# Altium schematic sheet Power.SchDoc
size A; SheetNumber: 5; SheetTotal: 7
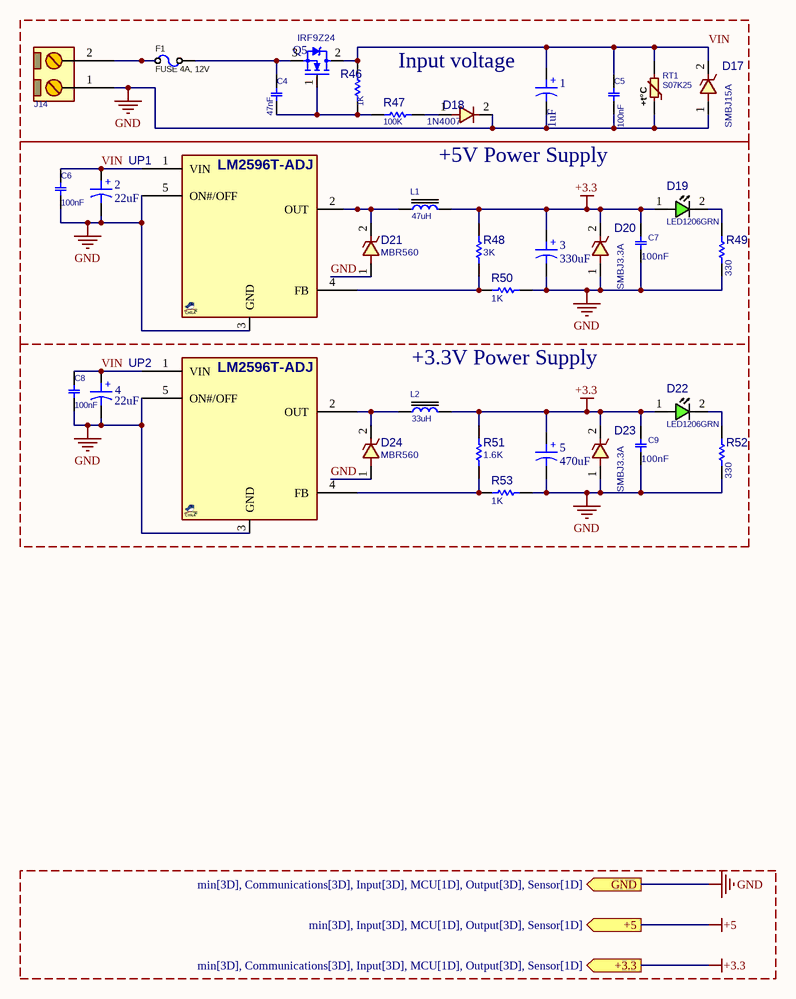
[diagram p0: Power.SchDoc]

## Parts
1  1uF  [Cap electrolitic radial 10x20-5]
2  22uF  [Cap electrolitic radial 10x20-5]
3  330uF  [Cap electrolitic radial 10x20-5]
4  22uF  [Cap electrolitic radial 10x20-5]
5  470uF  [Cap electrolitic radial 10x20-5]
C4  47nF  [C_CERM_D3]
C5  100nF  [C_CERM_D3]
C6  100nF  [C_CERM_D3]
C7  100nF  [C1206]
C8  100nF  [C_CERM_D3]
C9  100nF  [C1206]
D17  SMBJ15A  [D_SMB]
D18  1N4007  [D_AX03_1WS]
D19  LED1206GRN  [LED1206GRN]
D20  SMBJ3.3A  [D_SMB]
D21  MBR560  [D_AX04_DO41]
D22  LED1206GRN  [LED1206GRN]
D23  SMBJ3.3A  [D_SMB]
D24  MBR560  [D_AX04_DO41]
F1  FUSE 4A, 12V  [FUSH_6X32MM_4PIN]
J14  CONN_TB2  [TBB_2]  (value not drawn)
L1  47uH  [L_7]
L2  33uH  [L_7]
Q5  IRF9Z24  [TO247_3]
R46  1K  [R0125W_AX03]
R47  100K  [R0125W_AX03]
R48  3K  [R1206]
R49  330  [R1206]
R50  1K  [R1206]
R51  1.6K  [R1206]
R52  330  [R1206]
R53  1K  [R1206]
RT1  S07K25  [NTC_15X6]
UP1  LM2596T-ADJ  [TO220_5]  (value not drawn)
UP2  LM2596T-ADJ  [TO220_5]  (value not drawn)

## Ports
+3.3 (out, see min[3D], Communications[3D], Input[3D], MCU[1D], Output[3D], Sensor[1D]), +5 (out, see min[3D], Input[3D], MCU[1D], Output[3D], Sensor[1D]), GND (out, see min[3D], Communications[3D], Input[3D], MCU[1D], Output[3D], Sensor[1D])

## Nets
+3.3: 3.1 5.1 C7.1 C9.1 D19.1(ANODE) D20.2 D22.1(ANODE) D23.2 L1.2 L2.2 R48.1 R51.2 ; port +3.3
+5: port +5
GND: 1.2 2.2 3.2 4.2 5.2 C5.1 C6.1 C7.2 C8.1 C9.2 D17.1 D18.2 D20.1 D21.1 D23.1 D24.1 J14.1 R49.2 R50.2 R52.2 R53.2 RT1.1 UP1.3(GND) UP1.5(ON#/OFF) UP2.3(GND) UP2.5(ON#/OFF) ; port GND
VIN: 1.1 2.1 4.1 C5.2 C6.2 C8.2 D17.2 Q5.2(D) R46.2 RT1.2 UP1.1(VIN) UP2.1(VIN)
NetC4_1: C4.1 Q5.1(G) R46.1 R47.1
NetC4_2: C4.2 F1.2 Q5.3(S)
NetD18_1: D18.1 R47.2
NetD19_2: D19.2(CATHODE) R49.1
NetD21_2: D21.2 L1.1 UP1.2(OUT)
NetD22_2: D22.2(CATHODE) R52.1
NetD24_2: D24.2 L2.1 UP2.2(OUT)
NetF1_1: F1.1 J14.2
NetR48_2: R48.2 R50.1 UP1.4(FB)
NetR51_1: R51.1 R53.1 UP2.4(FB)

## Notes on the sheet
- (near 1) Input voltage
- +5V Power Supply
- +3.3V Power Supply
- (in symbol Cap electrolitic radial 10x21) +
- (in symbol PTC10K) +t°C

## Library data of the parts
1-5 = Cap electrolitic radial 10x21: Cap electrolitic radial; Part. No: 100U/50V; Designer: Abbas Basereh; Data: 16-12-2016
C4-C6 C8 = CAP_THD_CER: CAP, THD, CER MULTI LAYER,; DESC: CAP, CER MULTI LAYER,; MANF_P#: MANF_PART#; PARAM2: 50V; VALUE: 470pF; PRICE: 100= 1$; MANF: MANF; ASSEMBLY: ASSEMBLY
C7 C9 = CAP_SMD_MLCC: CAP, MLCC; PARAM: C0G, 10%; DESC: CAP, MLCC, 1nF, 50V, C0G, 10%, 0402; MANF_P#: MANF_PART#; MANF: Murata; PARAM2: 50V; VALUE: 20pF; PRICE: 100= 1$; ASSEMBLY: ASSEMBLY
D17 D20 D23 = DIODE_SMD_ZENER_Z2SMB36: DIODE, ZENER, 2W, 36V; MANF: Diotec; DESC: DESCRIPTION; PARAM: 2W, 16Ohm, -50~150°C; ASSEMBLY: ASSEMBLY; PRICE: -; PARAM2: 36V; MANF_P#: Z2SMB36
  D17: VALUE: SMBJ15A
  D20 D23: VALUE: SMBJ3.3A
D18 = DIODE_THD_1N4007: DIODE, GENERAL PURPOSE, 1000V/1A; MANF: Diodes; DESC: DESCRIPTION; PARAM: 1000V, 1.15V; PARAM2: 1.5A; ASSEMBLY: ASSEMBLY; PRICE: PRICE; MANF_P#: 1N4007; VALUE: 1N4007
D19 D22 = LED_SMD_1206_GRN: LED, SMD, 1206, GREEN; PARAM: 20mA; DESC: DESCRIPTION; PARAM2: 2.2V; MANF: -; ASSEMBLY: ASSEMBLY; PRICE: 36t@Javan; MANF_P#: -; VALUE: LED1206GRN
D21 D24 = DIODE_THD_ZENER: DIODE, ZENER, 0.2W, 15V; MANF: Diodes; DESC: DESCRIPTION; MANF_P#: ZENER15V; ASSEMBLY: ASSEMBLY; PRICE: PRICE; PARAM2: 0.2W; PARAM: 15V; VALUE: MBR560
F1 = FUSE_6X32: Fuse HOLDER 5X20; PARAM: 30A; MANF_P#: MANF_PART#; PARAM2: 125VAC; MANF: MANF; VALUE: FUSE 4A, 12V
J14 = CONN_TB2: CONN, TERMINAL BLOCK, 5.08mm pitch; VALUE: CONN_TB2
L1 L2 = IND_SMD_10uH_2A: INDUCTOR, 10uH 2A, 38mOhm, 2626; PARAM: 2A Irms, 2.05A Isat; MANF_P#: SRR6038-100Y; MANF: Bourns; PRICE: 2.5$; DESC: INDUCTOR, 10uH 2A, 38mOhm, 2626; PARAM2: 38mOhm; ASSEMBLY: ASSEMBLY; VALUE: 10uH
Q5 = MOSN_IRFP: MANF_P#: IRFP; ASSEMBLY: ASSEMBLY; VALUE: IRF9Z24
R46 R47 = RES_THD: RESISTOR, THD; MANF_P#: RK73H1ETTP4701F; MANF: KOA SPEER; PARAM: 0.063W; DESC: DESCRIPTION; DIST#: MOUSER; PARAM2: 1%; VALUE: 0; ASSEMBLY: ASSEMBLY; PRICE: 100= 0.5$
R48-R53 = RES_SMD: RESISTOR, SMD; PARAM: -W; DESC: DESCRIPTION; DIST#: MOUSER; PARAM2: 1%; VALUE: 470; MANF_P#: -; MANF: -; ASSEMBLY: ASSEMBLY; PRICE: 100= 0.5$
RT1 = PTC10K: Thermistor, NTC; MANF_P#: PTC; PARAM: 10K; MANF: -; PARAM2: -; PRICE: -; VALUE: S07K25
UP1 UP2 = VREG_LM2596T-ADJ_TO220: REG, Switching, Buck, 3A, ADJ, 150KHz, TO-220; MANF: TI, ON, TS; PARAM: 3A, ADJ; PARAM2: 150KHz, 40VIN; ASSEMBLY: ASSEMBLY; PRICE: PRICE; DESC: REG, Switching, Buck, 3A, ADJ, 150KHz, TO-220; MANF_P#: LM2596T-ADJ; VALUE: LM2596T-ADJ; PACKAGE: TO-220-5